# EAGLE design runes (EAGLE 7.6.0)
COMPANY: monome
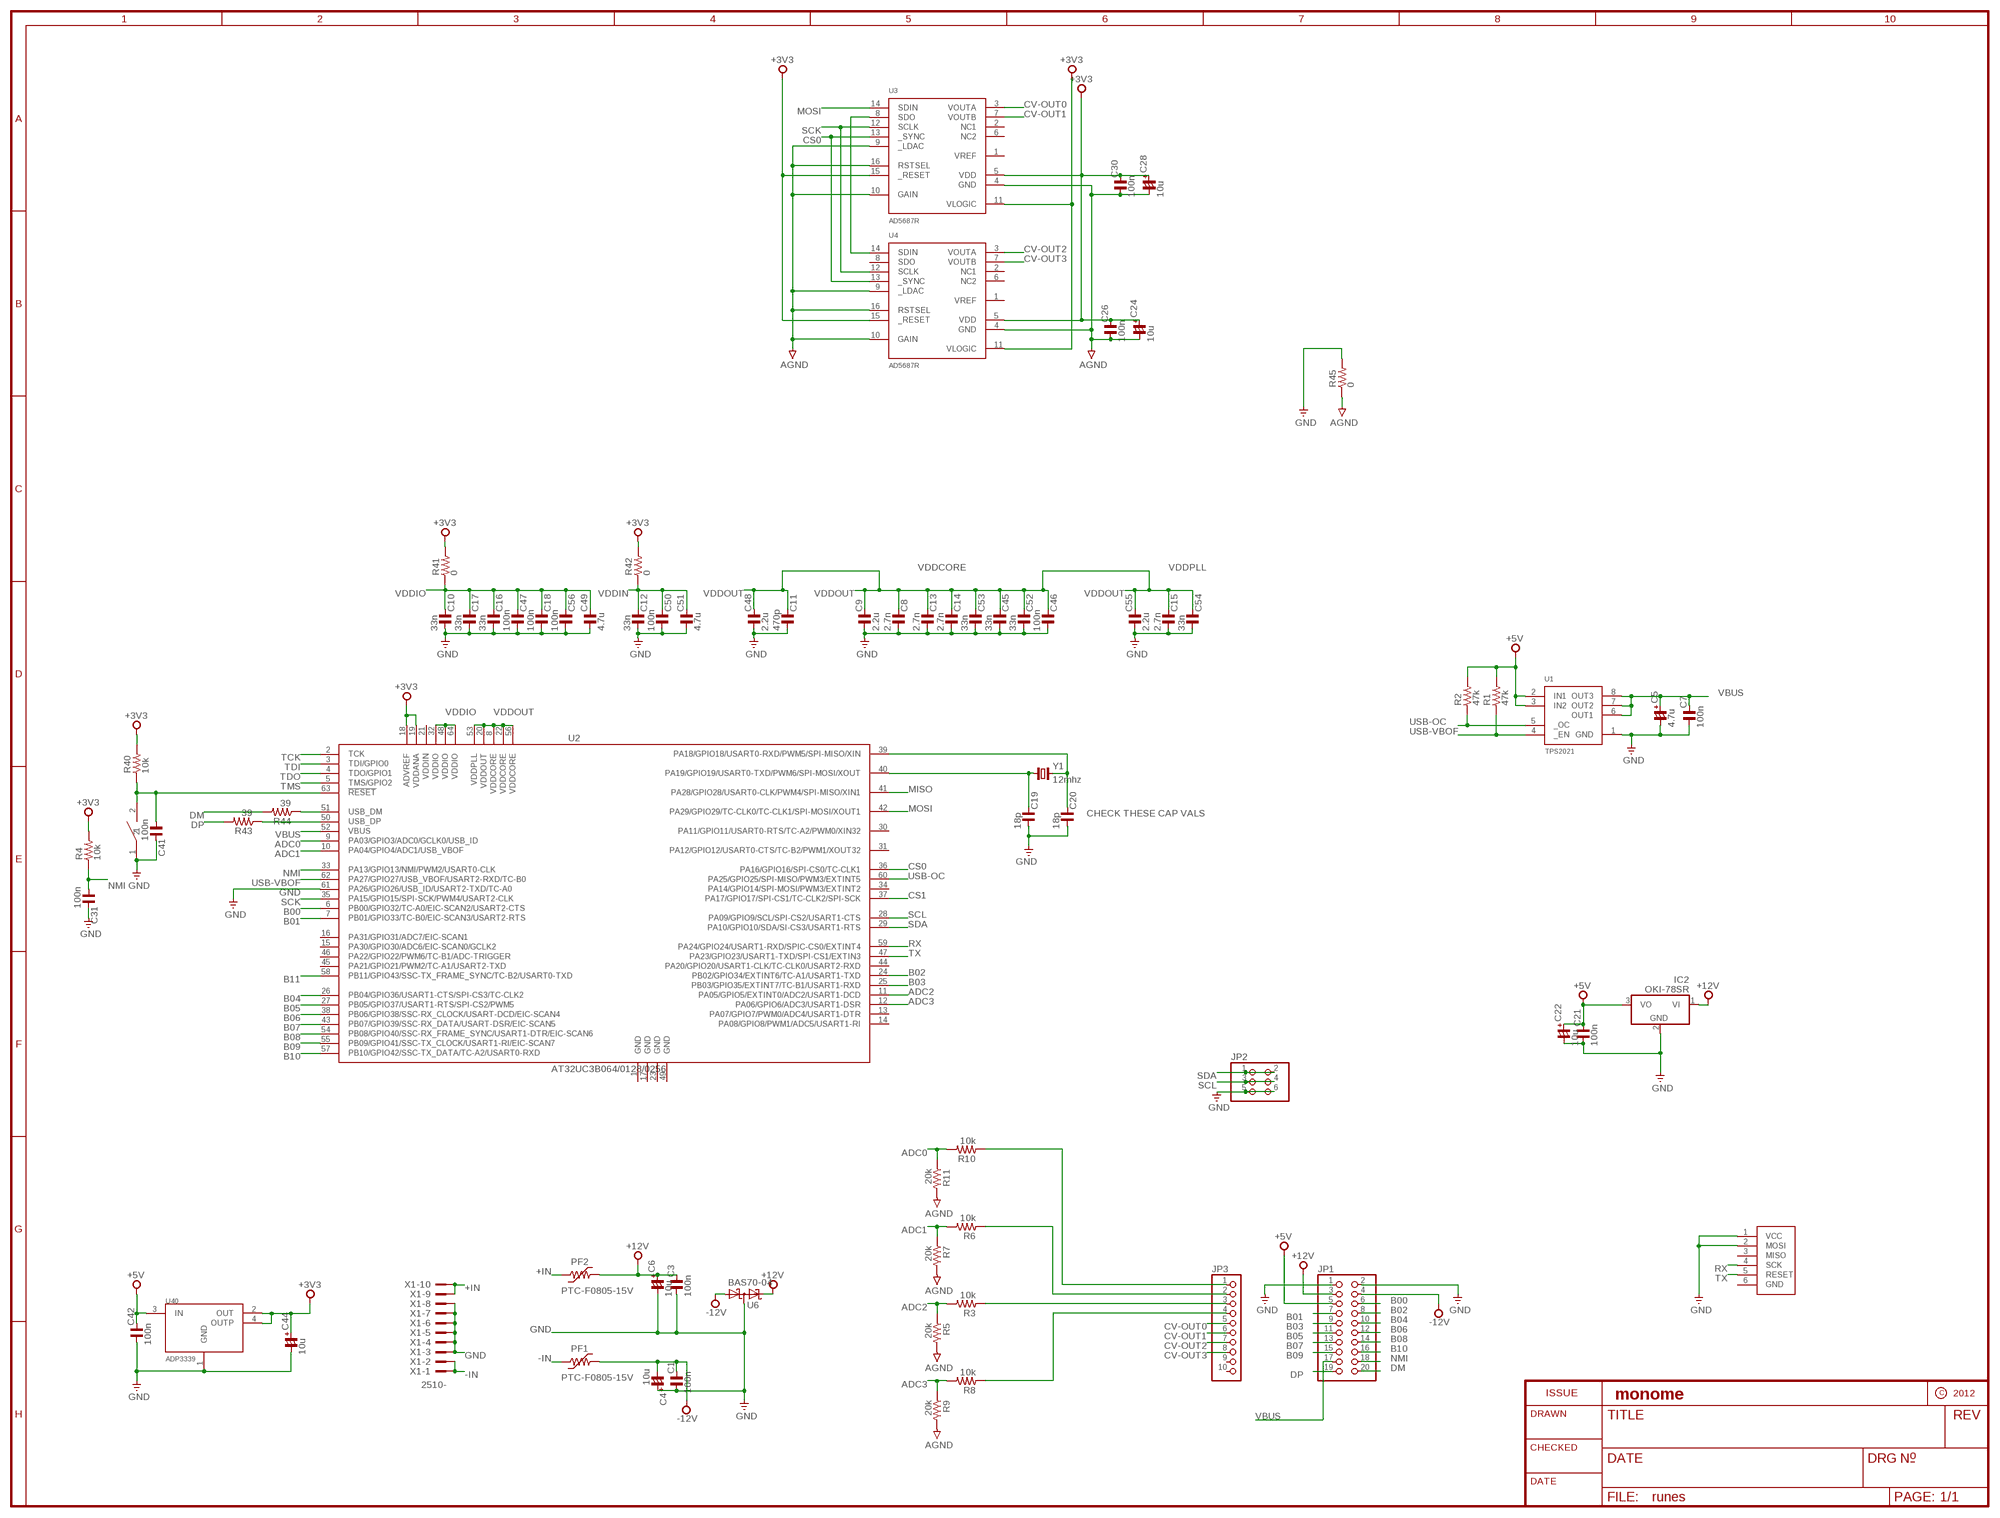
[diagram p0: schematic, sheet 1]

## Parts
C1  100n  C_0402  [C0402]
C3  100n  C_0402  [C0402]
C4  10u  CP_1206/T  [C1206/T]
C5  4.7u  CP_1206/T  [C1206/T]
C6  10u  CP_1206/T  [C1206/T]
C7  100n  C_0402  [C0402]
C8  2.7n  C_0402  [C0402]
C9  2.2u  C_0603  [C0603]
C10  33n  C_0402  [C0402]
C11  470p  C_0402  [C0402]
C12  33n  C_0402  [C0402]
C13  2.7n  C_0402  [C0402]
C14  2.7n  C_0402  [C0402]
C15  2.7n  C_0402  [C0402]
C16  33n  C_0402  [C0402]
C17  33n  C_0402  [C0402]
C18  100n  C_0402  [C0402]
C19  18p  C_0402  [C0402]
C20  18p  C_0402  [C0402]
C21  100n  C_0402  [C0402]
C22  10u  CP_1206/T  [C1206/T]
C24  10u  CP_1206/T  [C1206/T]
C26  100n  C_0402  [C0402]
C28  10u  CP_1206/T  [C1206/T]
C30  100n  C_0402  [C0402]
C31  100n  C_0402  [C0402]
C41  100n  C_0402  [C0402]
C42  100n  C_0402  [C0402]
C44  10u  CP_1206/T  [C1206/T]
C45  33n  C_0402  [C0402]
C46  100n  C_0402  [C0402]
C47  100n  C_0402  [C0402]
C48  2.2u  C_0603  [C0603]
C49  4.7u  C_0603  [C0603]
C50  100n  C_0402  [C0402]
C51  4.7u  C_0603  [C0603]
C52  33n  C_0402  [C0402]
C53  33n  C_0402  [C0402]
C54  33n  C_0402  [C0402]
C55  2.2u  C_0603  [C0603]
C56  100n  C_0402  [C0402]
IC2  OKI-78SR  7824TV  [TO220V]
J40  ISP-ROW  [ISP-ROW]
JP1  PINHD-2X10  [2X10]
JP2  PINHD-2X3  [2X03]
JP3  PINHD-1X10  [1X10]
PF1  PTC-F0805-15V  PTC-F0805  [F0805]
PF2  PTC-F0805-15V  PTC-F0805  [F0805]
R1  47k  R_0402  [R0402]
R2  47k  R_0402  [R0402]
R3  10k  R_0402  [R0402]
R4  10k  R_0402  [R0402]
R5  20k  R_0402  [R0402]
R6  10k  R_0402  [R0402]
R7  20k  R_0402  [R0402]
R8  10k  R_0402  [R0402]
R9  20k  R_0402  [R0402]
R10  10k  R_0402  [R0402]
R11  20k  R_0402  [R0402]
R40  10k  R_0402  [R0402]
R41  0  R_0402  [R0402]
R42  0  R_0402  [R0402]
R43  39  R_0402  [R0402]
R44  39  R_0402  [R0402]
R45  0  R_0402  [R0402]
SW40  PANASONIC-EVQ  [PANASONIC-EVQ]
U1  TPS2021  TPS2020  [SO08]
U2  AT32UC3B064/0128/0256  [TQFP64-10X10]
U3  AD5687R  AD5689R  [TSSOP16]
U4  AD5687R  AD5689R  [TSSOP16]
U6  BAS70-04  [SOT23]
U40  ADP3339  [SOT223]
X1  2510-  [PAK100/2500-10]
Y1  12mhz  CRYTALHC49UP  [HC49UP]

## Nets
+3V3: C24.+ C26.2 C28.+ C30.2 C44.+ R4.2 R40.2 R41.2 R42.2 U2.18(ADVREF) U2.19(VDDANA) U3.5(VDD) U3.11(VLOGIC) U3.15(_RESET) U4.5(VDD) U4.11(VLOGIC) U4.15(_RESET) U40.2(OUT) U40.4(OUTP)
+5V: C21.2 C22.+ C42.2 IC2.3(VO) JP1.5 R1.2 R2.2 U1.2(IN1) U1.3(IN2) U40.3(IN)
+12V: C3.2 C6.+ IC2.1(VI) JP1.3 PF2.2 U6.2(C2)
+IN: PF2.1 X1.9 X1.10
-12V: C1.2 C4.- JP1.4 PF1.2 U6.1(A1)
-IN: PF1.1 X1.1 X1.2
ADC0: R10.2 R11.1 U2.9(PA03/GPIO3/ADC0/GCLK0/USB_ID)
ADC1: R6.2 R7.1 U2.10(PA04/GPIO4/ADC1/USB_VBOF)
ADC2: R3.2 R5.1 U2.11(PA05/GPIO5/EXTINT0/ADC2/USART1-DCD)
ADC3: R8.2 R9.1 U2.12(PA06/GPIO6/ADC3/USART1-DSR)
AGND: C24.- C26.1 C28.- C30.1 R5.2 R7.2 R9.2 R11.2 R45.1 U3.4(GND) U3.9(_LDAC) U3.10(GAIN) U3.16(RSTSEL) U4.4(GND) U4.9(_LDAC) U4.10(GAIN) U4.16(RSTSEL)
B00: JP1.6 U2.6(PB00/GPIO32/TC-A0/EIC-SCAN2/USART2-CTS)
B01: JP1.7 U2.7(PB01/GPIO33/TC-B0/EIC-SCAN3/USART2-RTS)
B02: JP1.8 U2.24(PB02/GPIO34/EXTINT6/TC-A1/USART1-TXD)
B03: JP1.9 U2.25(PB03/GPIO35/EXTINT7/TC-B1/USART1-RXD)
B04: JP1.10 U2.26(PB04/GPIO36/USART1-CTS/SPI-CS3/TC-CLK2)
B05: JP1.11 U2.27(PB05/GPIO37/USART1-RTS/SPI-CS2/PWM5)
B06: JP1.12 U2.38(PB06/GPIO38/SSC-RX_CLOCK/USART-DCD/EIC-SCAN4)
B07: JP1.13 U2.43(PB07/GPIO39/SSC-RX_DATA/USART-DSR/EIC-SCAN5)
B08: JP1.14 U2.54(PB08/GPIO40/SSC-RX_FRAME_SYNC/USART1-DTR/EIC-SCAN6)
B09: JP1.15 U2.55(PB09/GPIO41/SSC-TX_CLOCK/USART1-RI/EIC-SCAN7)
B10: JP1.16 U2.57(PB10/GPIO42/SSC-TX_DATA/TC-A2/USART0-RXD)
B11: U2.58(PB11/GPIO43/SSC-TX_FRAME_SYNC/TC-B2/USART0-TXD)
CS0: U2.36(PA16/GPIO16/SPI-CS0/TC-CLK1) U3.13(_SYNC) U4.13(_SYNC)
CS1: U2.37(PA17/GPIO17/SPI-CS1/TC-CLK2/SPI-SCK)
CV-OUT0: JP3.5 U3.3(VOUTA)
CV-OUT1: JP3.6 U3.7(VOUTB)
CV-OUT2: JP3.7 U4.3(VOUTA)
CV-OUT3: JP3.8 U4.7(VOUTB)
DM: JP1.20 R44.2
DP: JP1.19 R43.2
GND: C1.1 C3.1 C4.+ C5.- C6.- C7.1 C8.1 C9.1 C10.1 C11.1 C12.1 C13.1 C14.1 C15.1 C16.1 C17.1 C18.1 C19.1 C20.1 C21.1 C22.- C31.2 C41.2 C42.1 C44.- C45.1 C46.1 C47.1 C48.1 C49.1 C50.1 C51.1 C52.1 C53.1 C54.1 C55.1 C56.1 IC2.2(GND) J40.1(VCC) J40.2(MOSI) JP1.1 JP1.2 JP2.5 JP2.6 R45.2 SW40.1 U1.1(GND) U2.61(PA26/GPIO26/USB_ID/USART2-TXD/TC-A0) U6.3(C1A2) U40.1(GND) X1.3 X1.4 X1.5 X1.6 X1.7 X1.8
MISO: U2.41(PA28/GPIO28/USART0-CLK/PWM4/SPI-MISO/XIN1)
MOSI: U2.42(PA29/GPIO29/TC-CLK0/TC-CLK1/SPI-MOSI/XOUT1) U3.14(SDIN)
N$1: R44.1 U2.51(USB_DM)
N$2: R43.1 U2.50(USB_DP)
N$3: JP3.1 R10.1
N$4: U3.8(SDO) U4.14(SDIN)
N$5: JP3.2 R6.1
N$6: JP3.3 R3.1
N$7: JP3.4 R8.1
N$14: C20.2 U2.39(PA18/GPIO18/USART0-RXD/PWM5/SPI-MISO/XIN) Y1.2
N$109: C19.2 U2.40(PA19/GPIO19/USART0-TXD/PWM6/SPI-MOSI/XOUT) Y1.1
NMI: C31.1 JP1.18 R4.1 U2.33(PA13/GPIO13/NMI/PWM2/USART0-CLK)
RESET: C41.1 R40.1 SW40.2 U2.63(!RESET)
RX: J40.4(SCK) U2.59(PA24/GPIO24/USART1-RXD/SPIC-CS0/EXTINT4)
SCK: U2.35(PA15/GPIO15/SPI-SCK/PWM4/USART2-CLK) U3.12(SCLK) U4.12(SCLK)
SCL: JP2.3 JP2.4 U2.28(PA09/GPIO9/SCL/SPI-CS2/USART1-CTS)
SDA: JP2.1 JP2.2 U2.29(PA10/GPIO10/SDA/SI-CS3/USART1-RTS)
TCK: U2.2(TCK)
TDI: U2.3(TDI/GPIO0)
TDO: U2.4(TDO/GPIO1)
TMS: U2.5(TMS/GPIO2)
TX: J40.5(RESET) U2.47(PA23/GPIO23/USART1-TXD/SPI-CS1/EXTIN3)
USB-OC: R2.1 U1.5(_OC) U2.60(PA25/GPIO25/SPI-MISO/PWM3/EXTINT5)
USB-VBOF: R1.1 U1.4(_EN) U2.62(PA27/GPIO27/USB_VBOF/USART2-RXD/TC-B0)
VBUS: C5.+ C7.2 JP1.17 U1.6(OUT1) U1.7(OUT2) U1.8(OUT3) U2.52(VBUS)
VDDIN: C12.2 C50.2 C51.2 R42.1
VDDIO: C10.2 C16.2 C17.2 C18.2 C47.2 C49.2 C56.2 R41.1 U2.32(VDDIO) U2.48(VDDIO) U2.64(VDDIO)
VDDOUT: C8.2 C9.2 C11.2 C13.2 C14.2 C15.2 C45.2 C46.2 C48.2 C52.2 C53.2 C54.2 C55.2 U2.8(VDDCORE) U2.20(VDDOUT) U2.22(VDDCORE) U2.53(VDDPLL) U2.56(VDDCORE)
Unconnected: J40.3(MISO) J40.6(GND) JP3.9 JP3.10 U2.13(PA07/GPIO7/PWM0/ADC4/USART1-DTR) U2.14(PA08/GPIO8/PWM1/ADC5/USART1-RI) U2.15(PA30/GPIO30/ADC6/EIC-SCAN0/GCLK2) U2.16(PA31/GPIO31/ADC7/EIC-SCAN1) U2.30(PA11/GPIO11/USART0-RTS/TC-A2/PWM0/XIN32) U2.31(PA12/GPIO12/USART0-CTS/TC-B2/PWM1/XOUT32) U2.34(PA14/GPIO14/SPI-MOSI/PWM3/EXTINT2) U2.44(PA20/GPIO20/USART1-CLK/TC-CLK0/USART2-RXD) U2.45(PA21/GPIO21/PWM2/TC-A1/USART2-TXD) U2.46(PA22/GPIO22/PWM6/TC-B1/ADC-TRIGGER) U3.1(VREF) U3.2(NC1) U3.6(NC2) U4.1(VREF) U4.2(NC1) U4.6(NC2) U4.8(SDO)

## Notes on the sheet
- VDDCORE | VDDPLL
- CHECK THESE CAP VALS

## Power pins joined to a net without a drawn wire
GND: U2.1(GND) U2.17(GND) U2.23(GND) U2.49(GND)
VDDIN: U2.21(VDDIN)

## Library data of the parts
C1 C3 C7-C21 C26 C30 C31 C41 C42 C45-C56 = rc-master-smd:C_: NON-POLARIZED CAP
C4-C6 C22 C24 C28 C44 = rc-master-smd:CP_: POLARIZED CAP
IC2 = linear:78*: Positive VOLTAGE REGULATOR Source: http://cache.national.com/ds/LM/LM78L05.pdf http://www.fairchildsemi.com/ds/LM/LM7805.pdf
J40 = monome-inc:ISP-ROW
JP1 = pinhead:PINHD-2X10: PIN HEADER
JP2 = pinhead:PINHD-2X3: PIN HEADER
JP3 = pinhead:PINHD-1X10: PIN HEADER
PF1 PF2 = polyswitch:PTC-: POLYSWITCH Polyswitch Resetable Fuses
R1-R11 R40-R45 = rc-master-smd:R_: RESISTOR
SW40 = monome-inc:PANASONIC-EVQ
U1 = monome-inc:TPS2020
U2 = atmel-avr32-michel-rev1:AT32UC3B064/0128/0256: AT32UC3B0128/0256/0512
U3 U4 = monome-inc:AD5689R
U6 = diode:BAS70-04: Silicon Schottky Diodes General-purpose diode for high-speed switching
U40 = monome-inc:ADP3339
X1 = con-3m:2510-: 3M (TM) Pak 100 4-Wall Header Source: 3M; MF: 3M; MPN: 2510-6002UB; OC_FARNELL: 9838244; OC_NEWARK: 46F4725
Y1 = crystal:CRYTAL: CRYSTAL

## Board
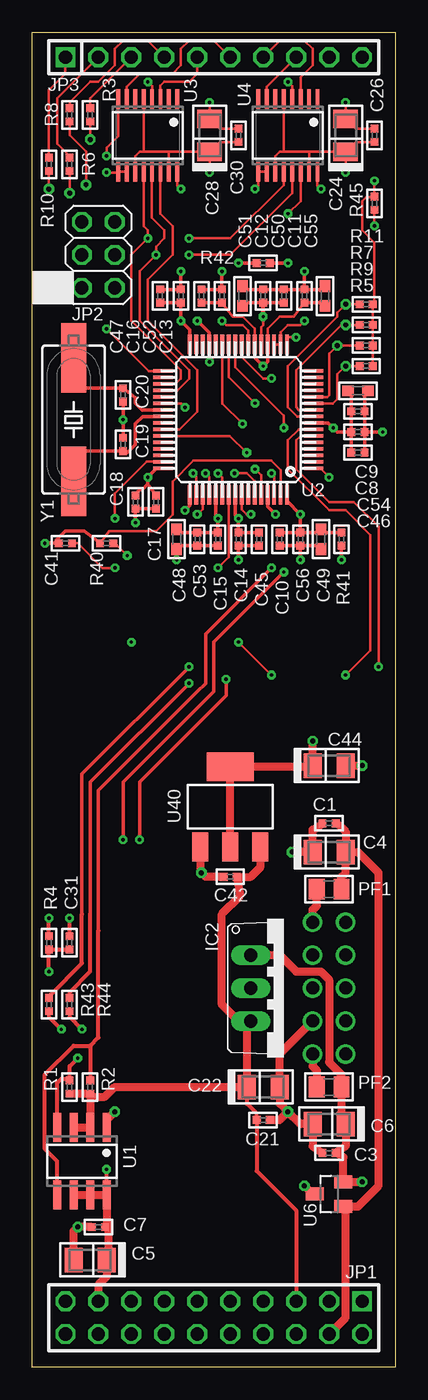
[diagram p1: board, top side]
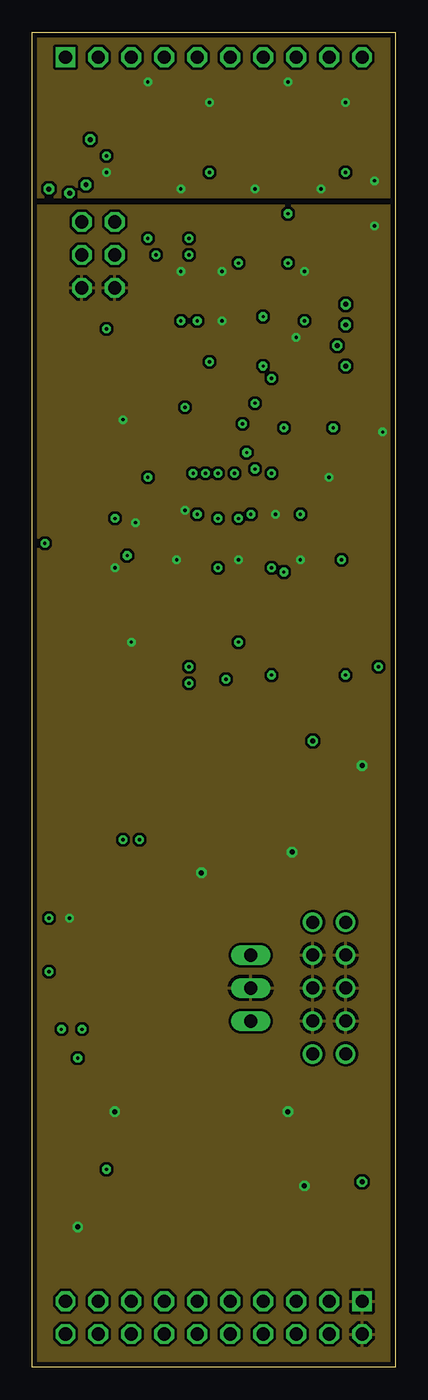
[diagram p2: board, inner layer GND]
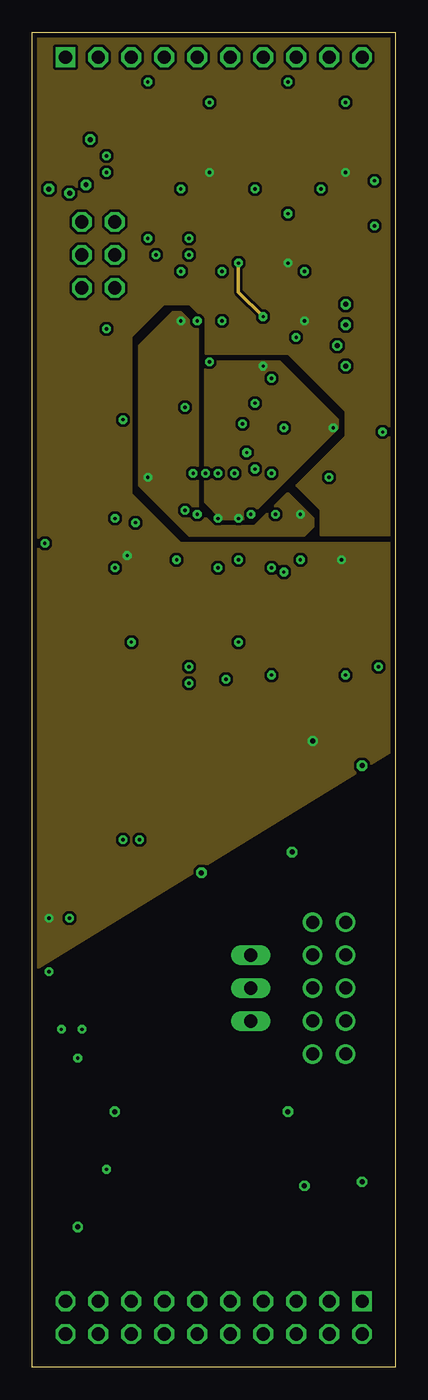
[diagram p3: board, inner layer PWR]
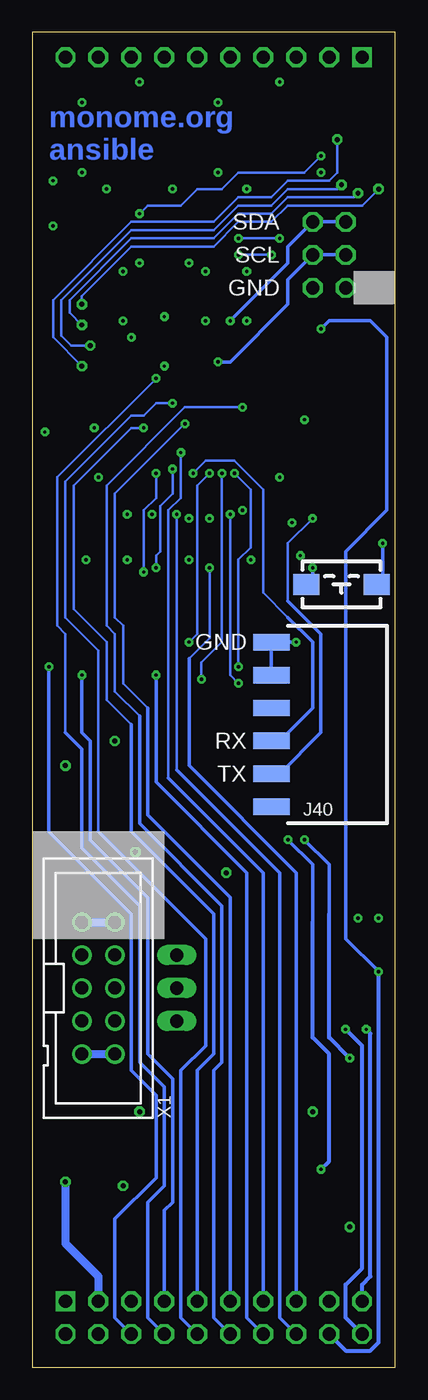
[diagram p4: board, bottom side, seen from below]

Size 27.94 x 102.87 mm. Coordinates in mm from the lower left corner, seen from the top.
Outline: 0,0 0,102.87 27.94,102.87 27.94,0 0,0
Copper layers (1*2+3*16): Top 0.035mm / dielectric 1.5mm / GND 0.035mm / dielectric 0.15mm / PWR 0.035mm / dielectric 0.2mm / Bottom 0.035mm
Design rules "default *": minimum track width 8mil, minimum drill 10mil, track to track 8mil, track to pad 8mil, pad to pad 8mil, via to via 8mil, smd to smd 0mil, copper to edge 15mil, drill to drill 8mil, minimum pad ring 10mil, minimum via ring 8mil, stop-mask expansion 4mil, vias tented up to drill 0mil, thermal gap 10mil
tKeepout: 4 lines

### Footprints (pad centres in the part's own frame; a part is rotated, then mirrored left to right if it is on the bottom)
C0402 = smd 0.6 x 0.6: 1 -0.508,0; 2 0.508,0
C1206/T = smd 1.4 x 1.9: + 1.27,0; - -1.27,0
C0603 = smd 0.9 x 0.8: 1 -0.762,0; 2 0.762,0
TO220V = drill 1.016 long: 1 -2.54,-2.54; 2 0,-2.54; 3 2.54,-2.54
ISP-ROW = smd 1.27 x 2.794: 1 -6.35,0; 2 -3.81,0; 3 -1.27,0; 4 1.27,0; 5 3.81,0; 6 6.35,0
2X10 = drill 1.016 square: 1 -11.43,-1.27 | drill 1.016 octagon: 2 -11.43,1.27; 3 -8.89,-1.27; 4 -8.89,1.27; 5 -6.35,-1.27; 6 -6.35,1.27; 7 -3.81,-1.27; 8 -3.81,1.27; 9 -1.27,-1.27; 10 -1.27,1.27; 11 1.27,-1.27; 12 1.27,1.27; 13 3.81,-1.27; 14 3.81,1.27; 15 6.35,-1.27; 16 6.35,1.27; 17 8.89,-1.27; 18 8.89,1.27; 19 11.43,-1.27; 20 11.43,1.27
2X03 = drill 1.016 octagon: 1 -2.54,-1.27; 2 -2.54,1.27; 3 0,-1.27; 4 0,1.27; 5 2.54,-1.27; 6 2.54,1.27
1X10 = drill 1.016 square: 1 -11.43,0 | drill 1.016 octagon: 2 -8.89,0; 3 -6.35,0; 4 -3.81,0; 5 -1.27,0; 6 1.27,0; 7 3.81,0; 8 6.35,0; 9 8.89,0; 10 11.43,0
F0805 = smd 1.2 x 1.6: 1 -0.953,0; 2 0.953,0
R0402 = smd 0.6 x 0.6: 1 -0.508,0; 2 0.508,0
PANASONIC-EVQ = smd 2 x 1.6: 1 2.7,0; 2 -2.7,0
SO08 = smd 0.6 x 2.2: 1 -1.905,-2.6; 2 -0.635,-2.6; 3 0.635,-2.6; 4 1.905,-2.6; 5 1.905,2.6; 6 0.635,2.6; 7 -0.635,2.6; 8 -1.905,2.6
TQFP64-10X10 = smd 1.5 x 0.28: 1 -5.8,3.75; 2 -5.8,3.25; 3 -5.8,2.75; 4 -5.8,2.25; 5 -5.8,1.75; 6 -5.8,1.25; 7 -5.8,0.75; 8 -5.8,0.25; 9 -5.8,-0.25; 10 -5.8,-0.75; 11 -5.8,-1.25; 12 -5.8,-1.75; 13 -5.8,-2.25; 14 -5.8,-2.75; 15 -5.8,-3.25; 16 -5.8,-3.75; 33 5.8,-3.75; 34 5.8,-3.25; 35 5.8,-2.75; 36 5.8,-2.25; 37 5.8,-1.75; 38 5.8,-1.25; 39 5.8,-0.75; 40 5.8,-0.25; 41 5.8,0.25; 42 5.8,0.75; 43 5.8,1.25; 44 5.8,1.75; 45 5.8,2.25; 46 5.8,2.75; 47 5.8,3.25; 48 5.8,3.75 | smd 0.28 x 1.5: 17 -3.75,-5.8; 18 -3.25,-5.8; 19 -2.75,-5.8; 20 -2.25,-5.8; 21 -1.75,-5.8; 22 -1.25,-5.8; 23 -0.75,-5.8; 24 -0.25,-5.8; 25 0.25,-5.8; 26 0.75,-5.8; 27 1.25,-5.8; 28 1.75,-5.8; 29 2.25,-5.8; 30 2.75,-5.8; 31 3.25,-5.8; 32 3.75,-5.8; 49 3.75,5.8; 50 3.25,5.8; 51 2.75,5.8; 52 2.25,5.8; 53 1.75,5.8; 54 1.25,5.8; 55 0.75,5.8; 56 0.25,5.8; 57 -0.25,5.8; 58 -0.75,5.8; 59 -1.25,5.8; 60 -1.75,5.8; 61 -2.25,5.8; 62 -2.75,5.8; 63 -3.25,5.8; 64 -3.75,5.8
TSSOP16 = smd 0.3 x 1.5: 1 -2.275,-2.8; 2 -1.625,-2.8; 3 -0.975,-2.8; 4 -0.325,-2.8; 5 0.325,-2.8; 6 0.975,-2.8; 7 1.625,-2.8; 8 2.275,-2.8; 9 2.275,2.8; 10 1.625,2.8; 11 0.975,2.8; 12 0.325,2.8; 13 -0.325,2.8; 14 -0.975,2.8; 15 -1.625,2.8; 16 -2.275,2.8
SOT23 = smd 1 x 1.4: 1 -0.95,-1.1; 2 0.95,-1.1; 3 0,1.1
SOT223 = smd 1.219 x 2.235: 1 -2.311,-3.099; 2 0,-3.099; 3 2.311,-3.099 | smd 3.6 x 2.2: 4 0,3.099
PAK100/2500-10 = drill 1 pad 1.422: 1 -5.08,-1.27; 2 -5.08,1.27; 3 -2.54,-1.27; 4 -2.54,1.27; 5 0,-1.27; 6 0,1.27; 7 2.54,-1.27; 8 2.54,1.27; 9 5.08,-1.27; 10 5.08,1.27
HC49UP = smd 5.334 x 1.93: 1 -4.763,0; 2 4.763,0

### Placement (x,y rotation side)
C1  22.86,41.91 0 top
C3  22.86,16.51 0 top
C4  22.86,39.69 180 top
C5  4.45,8.26 0 top
C6  22.86,18.73 0 top
C7  5.08,10.79 0 top
C8  25.08,73.66 180 top
C9  25.08,75.25 180 top
C10  19.05,63.82 90 top
C11  20.95,82.55 270 top
C12  17.78,82.55 270 top
C13  14.61,82.55 270 top
C14  15.88,63.82 90 top
C15  14.29,63.82 90 top
C16  11.43,82.55 270 top
C17  9.53,66.67 90 top
C18  7.94,66.67 90 top
C19  6.99,71.12 270 top
C20  6.99,74.93 90 top
C21  17.78,19.05 180 top
C22  17.78,21.59 180 top
C24  24.13,94.93 270 top
C26  26.35,94.93 270 top
C28  13.65,94.93 270 top
C30  15.88,94.93 270 top
C31  2.86,32.7 90 top
C41  2.54,63.5 0 top
C42  15.24,37.78 0 top
C44  22.86,46.35 180 top
C45  17.46,63.82 90 top
C46  25.08,70.48 180 top
C47  9.84,82.55 270 top
C48  11.11,63.82 90 top
C49  22.23,63.82 90 top
C50  19.37,82.55 270 top
C51  16.19,82.55 270 top
C52  13.02,82.55 270 top
C53  12.7,63.82 90 top
C54  25.08,72.07 180 top
C55  22.54,82.55 270 top
C56  20.64,63.82 90 top
IC2  19.37,29.21 270 top
J40  9.53,49.53 270 bottom
JP1  13.97,3.81 180 top
JP2  5.08,85.72 270 top
JP3  13.97,100.97 0 top
PF1  22.86,36.83 0 top
PF2  22.86,21.59 0 top
R1  2.86,21.59 270 top
R2  4.45,21.59 270 top
R3  4.45,96.52 270 top
R4  1.27,32.7 90 top
R5  25.72,77.15 0 top
R6  2.86,92.71 270 top
R7  25.72,80.33 0 top
R8  2.86,96.52 270 top
R9  25.72,78.74 0 top
R10  1.27,92.71 270 top
R11  25.72,81.92 0 top
R40  5.71,63.5 0 top
R41  23.81,63.82 270 top
R42  17.78,85.09 0 top
R43  1.27,27.94 270 top
R44  2.86,27.94 270 top
R45  26.35,89.69 270 top
SW40  4.13,60.33 180 bottom
U1  3.81,15.88 180 top
U2  15.88,73.03 180 top
U3  8.89,94.93 180 top
U4  19.68,94.93 180 top
U6  22.86,13.34 90 top
U40  15.24,43.18 0 top
X1  22.86,29.21 270 bottom
Y1  3.17,73.03 90 top

### Tracks (layer width: path | path; a pad name or v marks a point on that pad's centre or on a via)
+3V3  (via drill 0.25, 0.38)
  Top 0.203: v20.95,80.64 20.64,80.33 19.68,80.33 19.12,79.77 U2.18 U2.19 | C28.+ 10.52,93.66 | 10.52,93.66 8.56,93.66 | 8.56,93.66 8.26,93.66 7.92,93.32 U3.11 | U3.15 10.52,93.66 | U3.5 8.56,93.66 | C30.2 14.41,94.42 C28.+ | C28.+ v13.65,92.08 | C24.+ 21.31,93.66 | 21.31,93.66 19.36,93.66 | 19.36,93.66 19.05,93.66 18.71,93.32 U4.11 | U4.15 21.31,93.66 | U4.5 19.36,93.66 | C24.+ v24.13,92.08 | C26.2 24.89,94.42 C24.+ | R40.2 6.48,63.37 v7.3,62.55
  Top 0.254: R42.2 v19.68,85.09 | R41.2 v23.81,62.23
  Top 0.305: R4.2 v1.27,34.61
  Top 0.61: U40.2 U40.4 21.51,46.28 C44.+ v21.59,48.26
  pour PWR: 0,30.48 27.94,47.62 27.94,63.5 11.43,63.5 7.62,67.31 7.62,79.38 10.16,81.92 12.06,81.92 13.34,80.64 13.34,78.11 19.68,78.11 24.13,73.66 24.13,71.75 20.32,67.94 22.23,66.04 22.23,64.14 27.94,64.14 27.94,102.87 0,102.87
+5V
  Top 0.305: C22.+ 16.51,20.32 17.27,19.56 C21.2 17.27,15.11 20.32,12.06 JP1.5
  Top 0.61: R2.2 U1.2 U1.3 | R1.2 R2.2 | R2.2 4.45,20.95 4.57,20.83 5.59,20.83 6.35,21.59 C22.+ 16.51,26.67 IC2.3 15.88,26.67 14.61,27.94 14.61,34.92 16,36.32 C42.2 16.83,37.78 17.55,38.51 U40.3
+12V  (via drill 0.38)
  Top 0.61: v25.4,14.29 U6.2 23.96,16.17 C3.2 24.13,17.02 C6.+ 23.81,19.05 PF2.2 23.81,22.54 22.86,23.5 22.86,29.84 22.23,30.48 20.32,30.48 19.05,31.75 IC2.1
  Bottom 0.61: v25.4,14.29 25.4,9.53 22.86,6.99 JP1.3
+IN
  Top 0.61: X1.10 21.59,23.18 21.91,22.86 PF2.1
  Bottom 0.61: X1.9 X1.10
-12V
  Top 0.61: C4.- 25.08,39.69 26.67,38.1 26.67,13.97 25.09,12.38 U6.1 24.13,12.21 24.13,3.81 JP1.4 | PF1.2 23.81,37.78 24.13,38.1 C4.- | C1.2 23.62,41.78 24.13,41.27 C4.-
-IN
  Top 0.61: X1.2 21.59,35.24 21.91,35.56 PF1.1
  Bottom 0.61: X1.1 X1.2
ADC0  (via drill 0.38)
  Top 0.203: U2.9 20.39,73.28 19.68,73.98 19.68,77.15 23.5,80.96 23.5,81.28 v24.13,81.92 R11.1 | R10.2 v1.27,90.81
  Bottom 0.203: v1.27,90.81 2.54,89.53 8.26,89.53 9.53,88.27 12.06,88.27 13.97,86.36 20.32,86.36 24.13,82.55 v24.13,81.92
ADC1  (via drill 0.38)
  Top 0.203: U2.10 20.52,73.78 20.32,73.98 20.32,76.83 23.81,80.33 v24.13,80.33 R7.1 | R6.2 v2.86,90.49
  Bottom 0.203: v2.86,90.49 3.17,90.17 8.26,90.17 9.53,88.9 12.06,88.9 13.97,87 20.32,87 25.08,82.23 25.08,81.28 v24.13,80.33
ADC2  (via drill 0.38)
  Top 0.203: U2.11 23.16,74.28 23.5,74.61 23.5,76.52 v24.13,77.15 R5.1 | R3.2 v4.45,94.61
  Bottom 0.203: v4.45,94.61 4.45,92.08 5.08,91.44 8.26,91.44 9.53,90.17 12.06,90.17 13.97,88.27 20.32,88.27 26.35,82.23 26.35,79.38 v24.13,77.15
ADC3  (via drill 0.38)
  Top 0.203: U2.12 22.7,74.78 22.86,74.93 22.86,78.11 v23.5,78.74 R9.1 | R8.2 2.86,94.93 4.13,93.66 v4.13,91.12
  Bottom 0.203: v4.13,91.12 4.45,90.81 8.26,90.81 9.53,89.53 12.06,89.53 13.97,87.63 20.32,87.63 25.72,82.23 25.72,79.5 24.96,78.74 v23.5,78.74
AGND  (via drill 0.25)
  Top 0.203: U3.10 U3.9 6.56,92.08 v5.71,92.08 | U3.16 11.16,91.07 v11.43,90.81 | C30.1 14.41,95.44 C28.- v13.65,97.47 | U3.4 9.21,98.73 v8.89,99.06 | U4.10 U4.9 17.41,91.07 v17.14,90.81 | U4.16 21.96,91.07 v22.23,90.81 | v24.13,97.47 C24.- 24.89,95.44 C26.1 | U4.4 20.01,98.73 v19.68,99.06 | v26.35,91.44 R45.1 26.32,90.17 25.72,90.17 25.4,89.85 25.4,87.63 26.35,86.68 26.35,81.92 R11.2 R7.2 R9.2 R5.2
  pour GND: 0,102.87 0,90.17 27.94,90.17 27.94,102.87
B00  (via drill 0.25)
  Top 0.203: U2.6 20.66,71.78 20.32,71.44 20.32,69.22 22.86,66.67 24.77,66.67 26.67,64.77 v26.67,53.98
  Bottom 0.254: JP1.6 21.59,3.81 21.59,11.43 18.41,14.61 18.41,20.95 20.32,22.86 20.32,34.92 26.67,41.27 v26.67,53.98
B01  (via drill 0.25)
  Top 0.203: U2.7 20.52,72.28 19.68,71.44 19.68,69.22 22.86,66.04 24.13,66.04 26.04,64.14 26.04,55.24 v24.13,53.34
  Bottom 0.254: JP1.7 17.78,12.06 17.14,12.7 17.14,22.23 19.05,24.13 19.05,36.2 23.5,40.64 23.5,48.26 24.13,48.9 v24.13,53.34
B02  (via drill 0.25)
  Top 0.203: U2.24 16.12,77.86 17.78,76.2 v18.41,76.2
  Bottom 0.203: 25.4,48.9 25.4,56.52 26.04,57.15 26.04,68.58 v18.41,76.2
  Bottom 0.254: JP1.8 19.05,3.81 19.05,12.7 17.78,13.97 17.78,21.59 19.68,23.5 19.68,35.56 24.13,40.01 24.13,47.62 25.4,48.9
B03  (via drill 0.25)
  Top 0.203: U2.25 15.62,77.08 19.37,73.34 v19.37,72.39
  Bottom 0.203: 20.32,49.53 22.23,51.44 22.23,52.7 22.23,55.88 24.77,58.42 24.77,67.94 20.32,72.39 v19.37,72.39
  Bottom 0.254: JP1.9 15.24,22.86 13.97,24.13 13.97,34.92 20.32,41.27 20.32,49.53
B04  (via drill 0.25)
  Top 0.203: U2.26 15.12,76.31 v17.14,74.3
  Bottom 0.203: 22.86,41.27 22.86,52.7 22.86,55.24 25.4,57.78 25.4,68.26 20.32,73.34 19.37,73.34 18.41,74.3 v17.14,74.3
  Bottom 0.254: JP1.10 16.51,3.81 16.51,22.86 14.61,24.77 14.61,33.02 22.86,41.27
B05  (via drill 0.25)
  Top 0.203: U2.27 14.62,74.28 v16.19,72.71
  Bottom 0.203: 19.05,50.8 20.95,52.7 20.95,57.15 21.59,57.78 21.59,67.31 v16.19,72.71
  Bottom 0.254: JP1.11 12.7,36.2 19.05,42.55 19.05,50.8
B06  (via drill 0.25)
  Top 0.203: U2.38 11.45,74.28 v11.75,73.98
  Bottom 0.203: 19.68,50.16 21.59,52.07 21.59,53.34 21.59,56.52 22.23,57.15 22.23,67.94 16.19,73.98 v11.75,73.98
  Bottom 0.254: JP1.12 13.97,3.81 13.97,22.86 13.34,23.5 13.34,35.56 19.68,41.91 19.68,50.16
B07  (via drill 0.25)
  Top 0.203: U2.43 15.22,71.78 v16.51,70.48
  Bottom 0.203: 17.46,45.4 17.46,51.75 17.46,66.04 16.51,66.99 v16.51,70.48
  Bottom 0.254: JP1.13 10.16,38.1 17.46,45.4
B08  (via drill 0.25)
  Top 0.203: U2.54 14.62,68.56 v14.29,68.9 | v18.41,53.34 v15.88,55.88
  Bottom 0.203: v14.29,68.9 15.24,67.94 15.24,56.52 v15.88,55.88
  Bottom 0.254: JP1.14 11.43,3.81 11.43,38.1 18.41,45.09 v18.41,53.34
B09  (via drill 0.25)
  Top 0.203: U2.55 15.12,62.43 v14.29,61.59
  Bottom 0.203: v14.29,61.59 14.29,56.2 15.88,54.61
  Bottom 0.254: JP1.15 7.62,38.1 15.88,46.35 15.88,54.61
B10  (via drill 0.25)
  Top 0.203: U2.57 16.12,66.11 16.51,65.72 v16.83,65.72
  Bottom 0.203: 16.83,46.04 16.83,51.75 v16.83,65.72
  Bottom 0.254: JP1.16 8.89,3.81 8.89,38.1 16.83,46.04
CS0  (via drill 0.25)
  Top 0.203: U2.36 11.14,75.28 12.06,76.2 12.06,76.83 8.26,80.64 8.26,84.45 v9.53,85.72 9.53,86.36 10.16,87 10.16,87.63 9.21,88.58 U3.13 | U4.13 20.01,90.5 15.24,85.72 v12.06,85.72
  Bottom 0.203: v12.06,85.72 v9.53,85.72
CV-OUT0
  Top 0.203: U3.3 9.87,98.77 10.16,99.06 12.06,99.06 12.7,99.69 JP3.5
CV-OUT1
  Top 0.203: U3.7 7.26,98.7 8.26,99.69 10.79,99.69 11.43,100.33 11.43,101.6 12.06,102.23 13.97,102.23 JP3.6
CV-OUT2
  Top 0.203: U4.3 20.66,99.4 21.59,100.33 21.59,101.6 20.95,102.23 19.05,102.23 JP3.7
CV-OUT3
  Top 0.203: U4.7 18.06,98.7 JP3.8
DM  (via drill 0.25)
  Top 0.254: R44.2 2.86,26.99
  Top 0.305: 2.86,26.99 v3.81,26.04
  Bottom 0.305: JP1.20 3.81,3.81 3.81,6.35 2.54,7.62 2.54,24.77 v3.81,26.04
DP  (via drill 0.25)
  Top 0.254: R43.2 1.27,26.99
  Top 0.305: 1.27,26.99 v2.22,26.04
  Bottom 0.305: JP1.19 2.54,6.35 1.91,6.99 1.91,25.72 v2.22,26.04
GND  (via drill 0.25, 0.38)
  Top 0.203: U2.23 16.62,79.89 16.19,80.33 14.92,80.33 v14.61,80.64 | 19.68,79.38 v20.32,79.38 | C41.2 3.49,63.5 5.4,61.59 v6.35,61.59 | R45.2 v26.35,87.95 | U2.1 22.16,69.28 v22.86,68.58
  Top 0.254: U2.17 19.62,79.31 19.68,79.38 | C11.1 22.42,83.06 22.54,83.19 C55.1 | C51.1 16.19,83.19 16.32,83.06 C12.1 C50.1 C11.1 | C11.1 v20.95,84.45 | C52.1 C13.1 v14.61,84.45 | C9.1 25.72,75.25 25.59,75.12 C8.1 C54.1 | C54.1 v26.99,72.07 | C46.1 C54.1 | C15.1 C53.1 11.24,63.31 11.11,63.18 C48.1 v11.11,62.23 | C45.1 C14.1 v15.88,62.23 | C49.1 22.23,63.18 22.1,63.31 C56.1 | C56.1 v20.64,62.23 | C10.1 C56.1 | C17.1 C18.1 v7.94,65.09 | C47.1 C16.1 v11.43,84.45 | U2.49 12.12,66.42 v11.75,66.04 | U2.61 18.12,66.33 v18.73,65.72 | C19.1 v6.99,73.03 C20.1
  Top 0.305: C31.2 v2.86,34.61
  Top 0.61: U1.1 5.71,19.05 v6.35,19.68 | X1.8 19.05,24.13 C22.- 19.05,20.32 v19.68,19.68 | C3.1 21.59,17.02 C6.- 20.64,18.73 v19.68,19.68 | C21.1 19.05,19.05 v19.68,19.68 | U6.3 21.59,13.34 v20.95,13.97 | C1.1 21.59,41.4 C4.+ v20,39.69 | C44.- v25.4,46.35 | C42.1 13.34,37.78 v13.02,38.1 12.93,38.19 U40.1 | C7.1 v3.49,10.79 3.17,10.48 C5.-
  Bottom 0.254: v6.35,61.59 6.35,60.33 SW40.1 | J40.2 J40.1 v7.62,55.88
  pour GND: 0,0 27.94,0 27.94,89.53 0,89.53
MOSI
  Top 0.203: U2.42 11.31,72.28 12.7,73.66 12.7,76.83 8.89,80.64 8.89,83.82 10.79,85.72 10.79,87.95 9.84,88.9 9.84,92.11 U3.14
N$1  (via drill 0.25)
  Top 0.203: U2.51 13.12,66.15 v12.7,65.72
  Top 0.254: 4.45,34.92 4.45,45.09 v12.06,52.7
  Top 0.305: 4.45,34.92 4.45,30.48 2.86,28.89 R44.1
  Bottom 0.203: v12.7,65.72 12.7,53.34 v12.06,52.7
N$2  (via drill 0.25)
  Top 0.203: U2.50 12.62,68.66 v12.38,68.9
  Top 0.254: 3.81,34.92 3.81,45.72 v12.06,53.98
  Top 0.305: 3.81,34.92 3.81,31.11 1.4,28.7 R43.1
  Bottom 0.203: v12.38,68.9 11.11,67.63 11.11,63.18 12.06,62.23 v12.06,53.98
N$3
  Top 0.203: JP3.1 2.54,99.69 1.27,98.42 R10.1
N$4  (via drill 0.25)
  Top 0.203: U3.8 6.62,94.88 5.71,93.98 v5.71,93.34 | v19.68,88.9 20.66,89.88 U4.14
  Bottom 0.203: v5.71,93.34 6.99,92.08 12.06,92.08 13.34,90.81 15.24,90.81 16.51,89.53 19.05,89.53 v19.68,88.9
N$5
  Top 0.203: JP3.2 1.91,97.79 1.91,94.42 1.91,94.3 2.86,93.34 R6.1
N$6
  Top 0.203: JP3.3 4.45,97.79 R3.1
N$7
  Top 0.203: JP3.4 8.89,102.23 6.99,102.23 6.35,101.6 6.35,100.33 5.08,99.06 4.45,99.06 2.86,97.47 R8.1
N$14
  Top 0.254: Y1.2 3.17,75.56 3.3,75.69 3.49,75.56 3.62,75.44 C20.2 7.94,74.74 7.94,74.3 8.46,73.78 U2.39
N$109
  Top 0.254: Y1.1 3.17,70.48 3.3,70.36 3.49,70.48 3.62,70.61 C19.2 7.3,70.48 7.94,71.12 7.94,71.31 7.94,72.71 8.51,73.28 U2.40
NMI  (via drill 0.25)
  Top 0.203: U2.33 8.95,76.78 v5.71,80.01
  Top 0.305: v1.27,30.48 R4.1 C31.1
  Bottom 0.254: v1.27,30.48 3.81,33.02 3.81,36.83 3.81,62.87 0.64,66.04 0.64,79.38 1.91,80.64 5.08,80.64 v5.71,80.01
  Bottom 0.305: JP1.18 3.81,1.27 1.91,1.27 1.27,1.91 v1.27,30.48
RESET  (via drill 0.25)
  Top 0.203: U2.63 19.12,69.14 18.41,69.85 12.38,69.85 10.79,68.26 10.79,65.72 9.53,64.45 5.91,64.45 R40.1
  Top 0.254: v0.95,63.5 C41.1 1.91,63.82 2.1,64.01 2.54,64.45 4,64.45 R40.1
  Bottom 0.254: v0.95,63.5 0.95,60.7 SW40.2
RX  (via drill 0.25)
  Top 0.203: U2.59 17.12,68.28 16.51,68.9 v15.56,68.9
  Bottom 0.203: v15.56,68.9 14.61,69.85 12.38,69.85 10.16,67.63 10.16,59.69 8.26,57.78
  Bottom 0.254: J40.4 8.89,48.26 6.35,50.8 6.35,55.88 8.26,57.78
SCK  (via drill 0.25)
  Top 0.203: U3.12 8.56,87.95 8.89,87.63 v8.89,87 7.62,85.72 7.62,80.64 11.43,76.83 11.43,76.2 11.01,75.78 U2.35 | U4.12 19.36,91.11 15.24,87 v12.06,87
  Bottom 0.203: v8.89,87 v12.06,87
SCL  (via drill 0.25)
  Top 0.203: U2.28 14.12,77.94 v13.65,77.47
  Bottom 0.254: v13.65,77.47 12.7,77.47 8.26,81.92 8.26,83.82 JP2.4 JP2.3
SDA  (via drill 0.25)
  Top 0.254: U2.29 13.62,79.72 v12.7,80.64
  Bottom 0.254: v12.7,80.64 8.26,85.09 8.26,86.36 JP2.2 JP2.1
TX  (via drill 0.25)
  Top 0.203: U2.47 8.81,69.78 6.35,67.31 v6.35,65.41
  Bottom 0.203: v6.35,65.41 8.26,63.5 8.26,59.05
  Bottom 0.254: J40.5 8.89,45.72 5.71,48.9 5.71,56.52 8.26,59.05
USB-OC  (via drill 0.25)
  Top 0.203: U2.60 17.62,68.73 v17.14,69.22
  Top 0.254: 5.08,33.66 5.08,44.45 12.7,52.07 13.34,52.7 13.34,56.52 v18.41,61.59
  Top 0.305: U1.5 1.91,15.88 0.95,16.83 0.95,22.54 3.17,24.77 4.45,24.77 | 4.45,24.77 R2.1 | 4.45,24.77 5.08,25.4 5.08,33.66
  Bottom 0.203: v17.14,69.22 17.14,67.31 18.1,66.36 18.1,62.87 18.41,62.55 v18.41,61.59
USB-VBOF  (via drill 0.25)
  Top 0.203: U2.62 18.62,68.69 v18.41,68.9
  Top 0.254: v6.99,40.64 6.99,45.09 13.97,52.07 13.97,55.88 v19.37,61.28
  Top 0.305: U1.4 1.91,21.91 2.22,22.23 2.73,22.23 R1.1 2.86,23.18 v3.49,23.81
  Bottom 0.203: v18.41,68.9 18.41,66.99 19.37,66.04 v19.37,61.28
  Bottom 0.254: 5.08,34.92 5.08,38.73 v6.99,40.64
  Bottom 0.305: v3.49,23.81 5.08,25.4 5.08,34.92
VBUS  (via drill 0.25)
  Top 0.203: U2.52 13.62,68.61 v13.34,68.9
  Top 0.254: v8.26,40.64 8.26,45.09 14.92,51.75 v14.92,53.02
  Top 0.305: U1.8 v5.71,15.24
  Top 0.61: U1.6 U1.7 U1.8 5.71,10.92 C7.2 5.71,10.79 5.84,10.67 5.84,8.38 C5.+ 5.71,6.99 5.08,6.35 JP1.17
  Bottom 0.203: v13.34,68.9 13.34,55.88 14.92,54.29 v14.92,53.02
  Bottom 0.254: 6.35,34.29 6.35,38.73 v8.26,40.64
  Bottom 0.305: v5.71,15.24 5.08,15.88 5.08,24.13 6.35,25.4 6.35,34.29
VDDIN  (via drill 0.25)
  Top 0.203: U2.21 17.62,80.17 17.78,80.33 v17.78,80.96
  Top 0.254: R42.1 v15.88,85.09 | C51.2 16.19,81.92 16.32,82.04 C12.2 C50.2
  Top 0.305: v17.78,80.96 C12.2
  PWR 0.254: v15.88,85.09 15.88,82.87 v17.78,80.96
VDDIO  (via drill 0.25)
  Top 0.254: U2.48 9.59,69.28 v8.89,68.58 8.89,68.07 | 8.89,68.07 C17.2 | C18.2 8.06,67.44 8.26,67.63 8.45,67.63 8.89,68.07 | U2.64 19.62,66.73 v20.64,65.72 C56.2 | C10.2 C56.2 | C56.2 22.1,64.33 22.23,64.45 | 22.23,64.45 C49.2 22.23,64.45 | 22.23,64.45 22.35,64.33 R41.1 | U2.32 12.12,79.95 v11.43,80.64 C16.2 C47.2
  pour PWR: 19.68,67.31 21.59,65.41 21.59,64.77 20.95,64.14 12.06,64.14 8.26,67.94 8.26,78.74 10.79,81.28 11.43,81.28 12.7,80.01 12.7,66.04 13.97,64.77 17.14,64.77
VDDOUT  (via drill 0.25)
  Top 0.203: U2.22 17.12,80.03 16.19,80.96 15.43,80.96 C13.2 | U2.20 18.12,80.04 19.05,80.96 20.13,80.96 C11.2
  Top 0.254: C52.2 C13.2 | C11.2 22.42,82.04 22.54,81.92 C55.2 | U2.22 17.12,77.81 v17.78,77.15 18.12,77.5 U2.20 | C9.2 24.45,75.25 24.57,75.12 C8.2 C54.2 | C54.2 C46.2 | U2.8 22.79,72.78 v23.18,72.39 23.5,72.07 C54.2 | C48.2 11.11,64.45 11.24,64.33 C53.2 C15.2 v14.29,65.41 14.12,65.57 U2.53 | C45.2 C14.2 v15.88,65.41 15.62,65.66 U2.56
  pour PWR: 19.05,77.47 13.34,77.47 13.34,66.67 14.61,65.41 16.51,65.41 23.5,72.39 23.5,73.03

### Text on the board
Bottom: monome.org / ansible
bPlace: SDA | SCL | GND | GND | RX | TX
bStop: monome.org / ansible